# Altium schematic sheet Cover-Page.SchDoc
size C; SheetNumber: 1; SheetTotal: 15
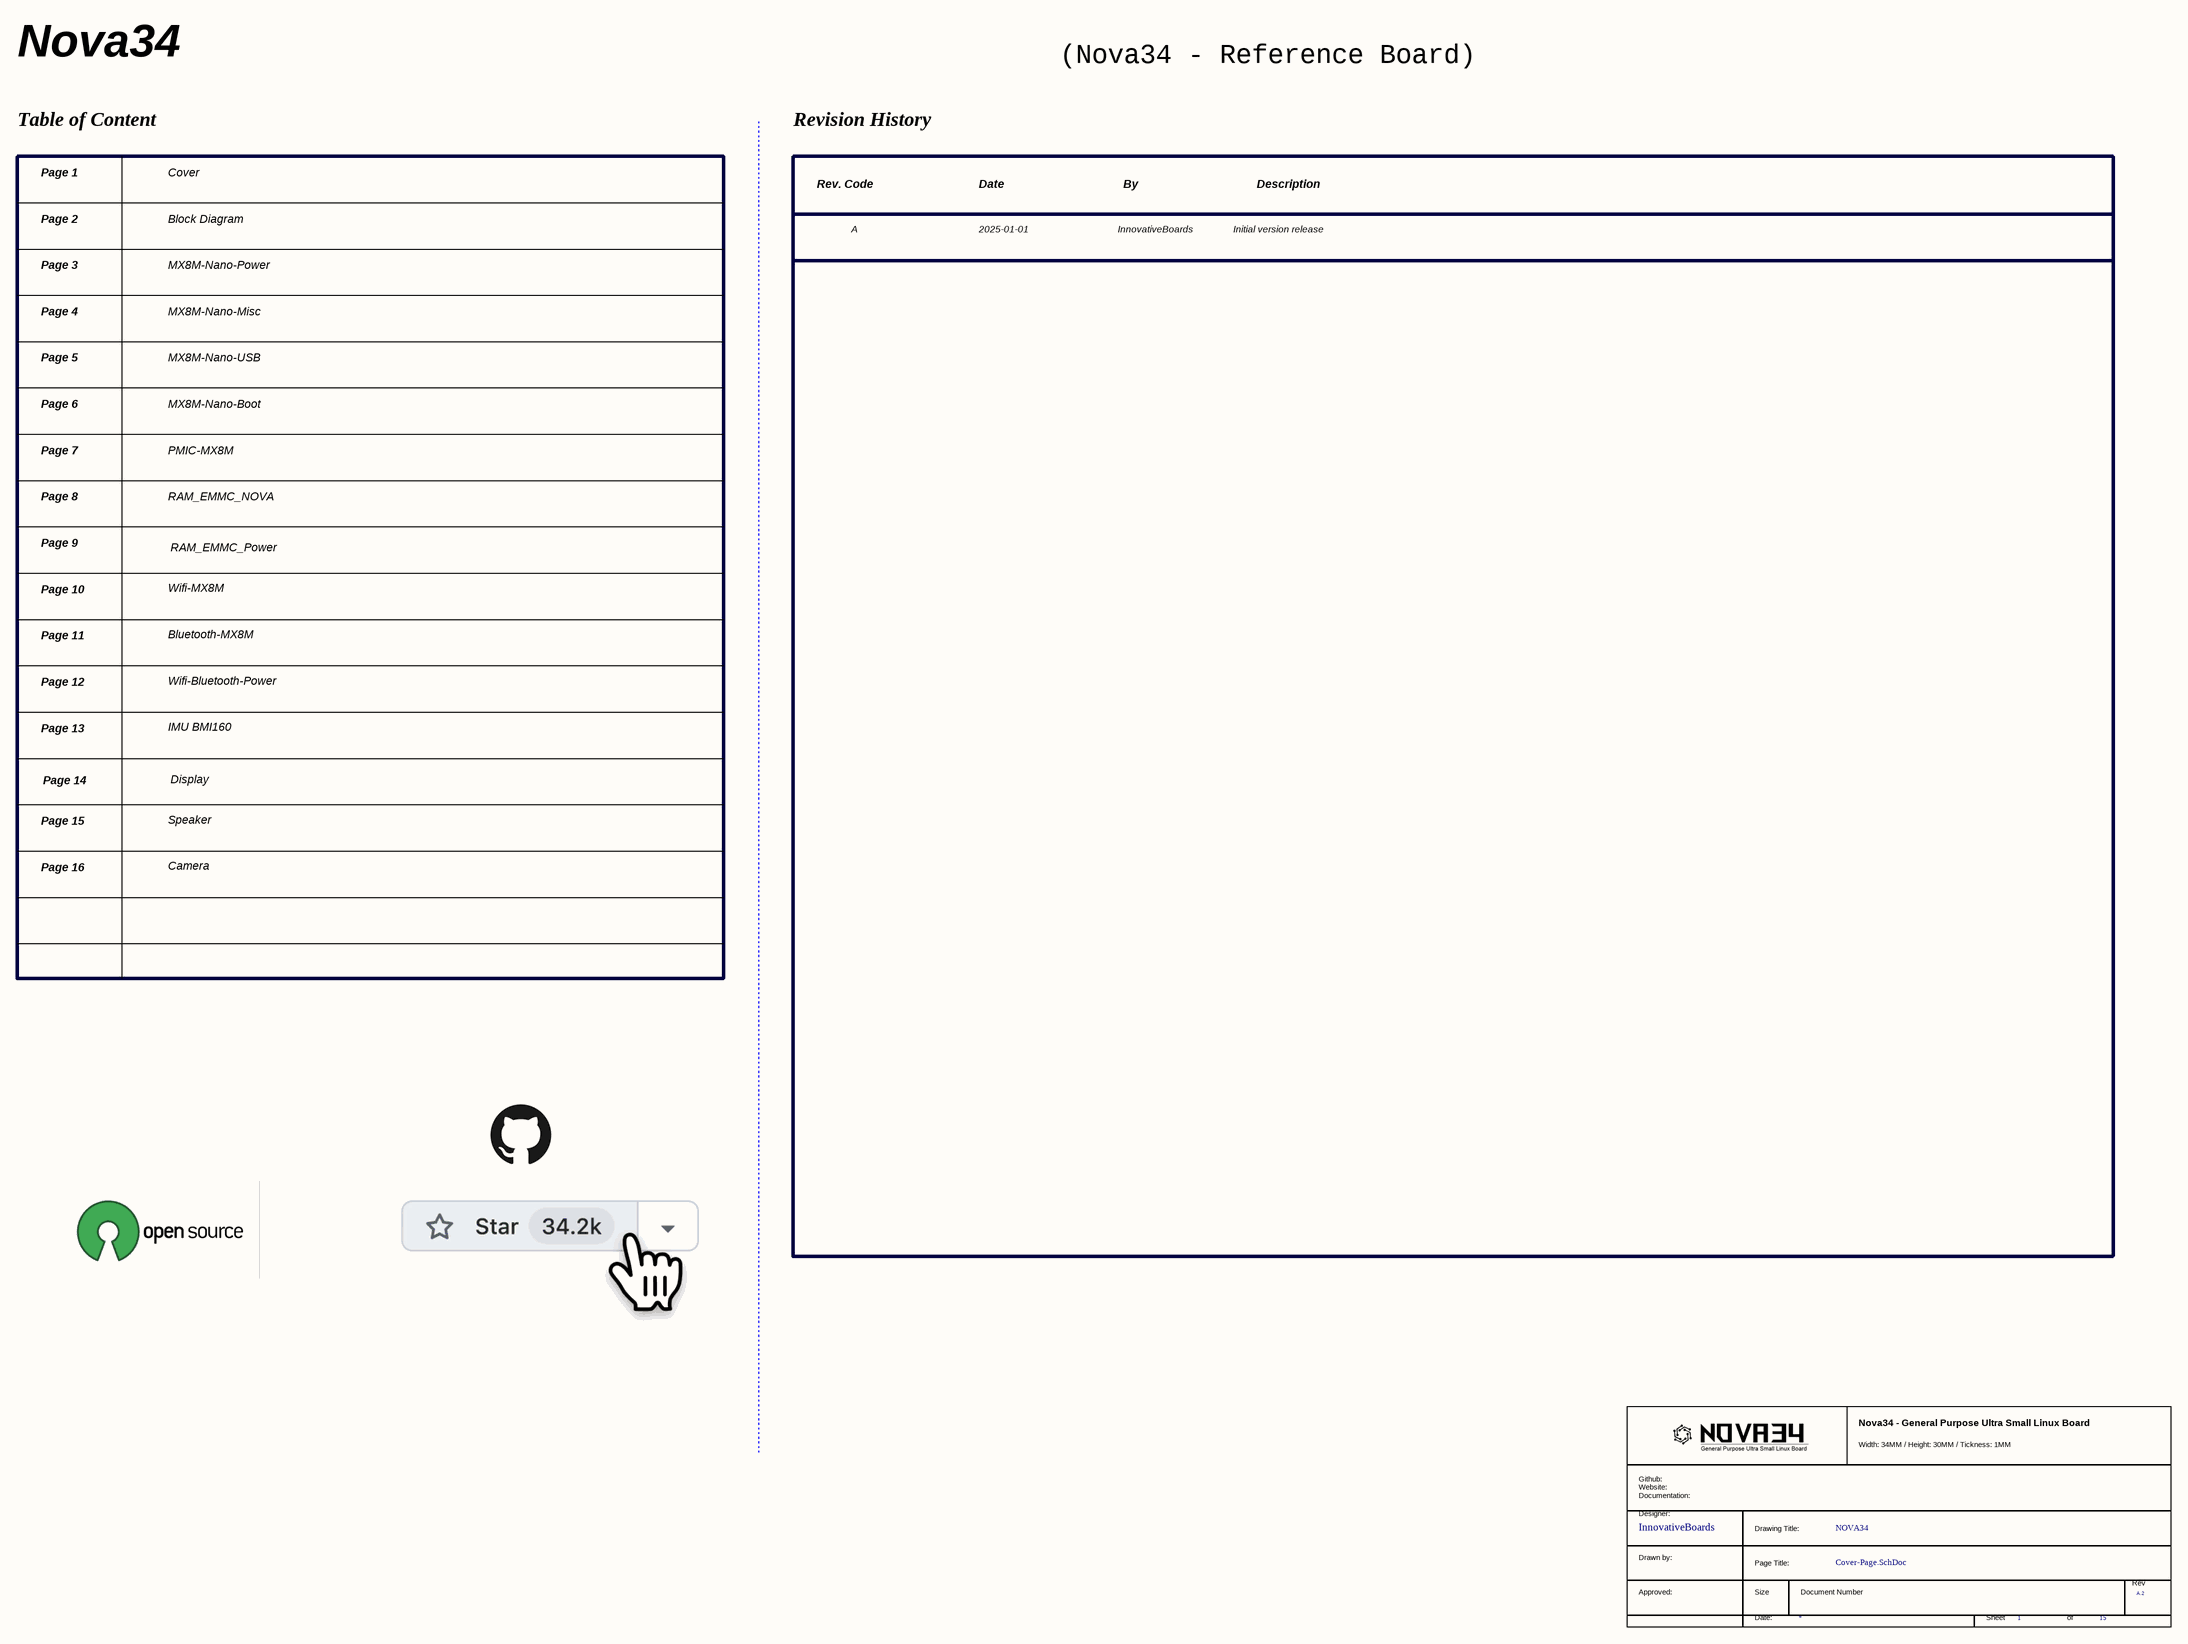
[diagram p0: Cover-Page.SchDoc]

## Parts
*  RevCode: A.2  (hidden comment: TitleBlock_MCPG)  (graphical)

## Notes on the sheet
- Nova34
- (Nova34 - Reference Board)
- Table of Content
- Page 1
- Cover
- Revision History
- Page 2
- Block Diagram
- Rev. Code
- A
- Date
- 2025-01-01
- InnovativeBoards
- By
- Initial version release
- Description
- Page 3
- MX8M-Nano-Power
- Page 4
- MX8M-Nano-Misc
- Page 5
- Page 6
- MX8M-Nano-USB
- MX8M-Nano-Boot
- Page 7
- PMIC-MX8M
- Page 8
- RAM_EMMC_NOVA
- Page 9
- RAM_EMMC_Power
- Page 10
- Page 11
- Wifi-MX8M
- Bluetooth-MX8M
- Page 12
- Wifi-Bluetooth-Power
- Page 13
- IMU BMI160
- Page 14
- Display
- Page 15
- Page 16
- Speaker
- Camera
- (in symbol TitleBlock_MCPG) Nova34 - General Purpose Ultra Small Linux Board; Width: 34MM / Height: 30MM / Tickness: 1MM; Github: / Website: / Documentation:; Designer:; InnovativeBoards; Drawing Title:; NOVA34; Drawn by:; Page Title:; Rev; Approved:; Size; Document Number; Date:; Sheet; of

## Library data of the parts
* = TitleBlock_MCPG: Page Create Date: March  8, 1995